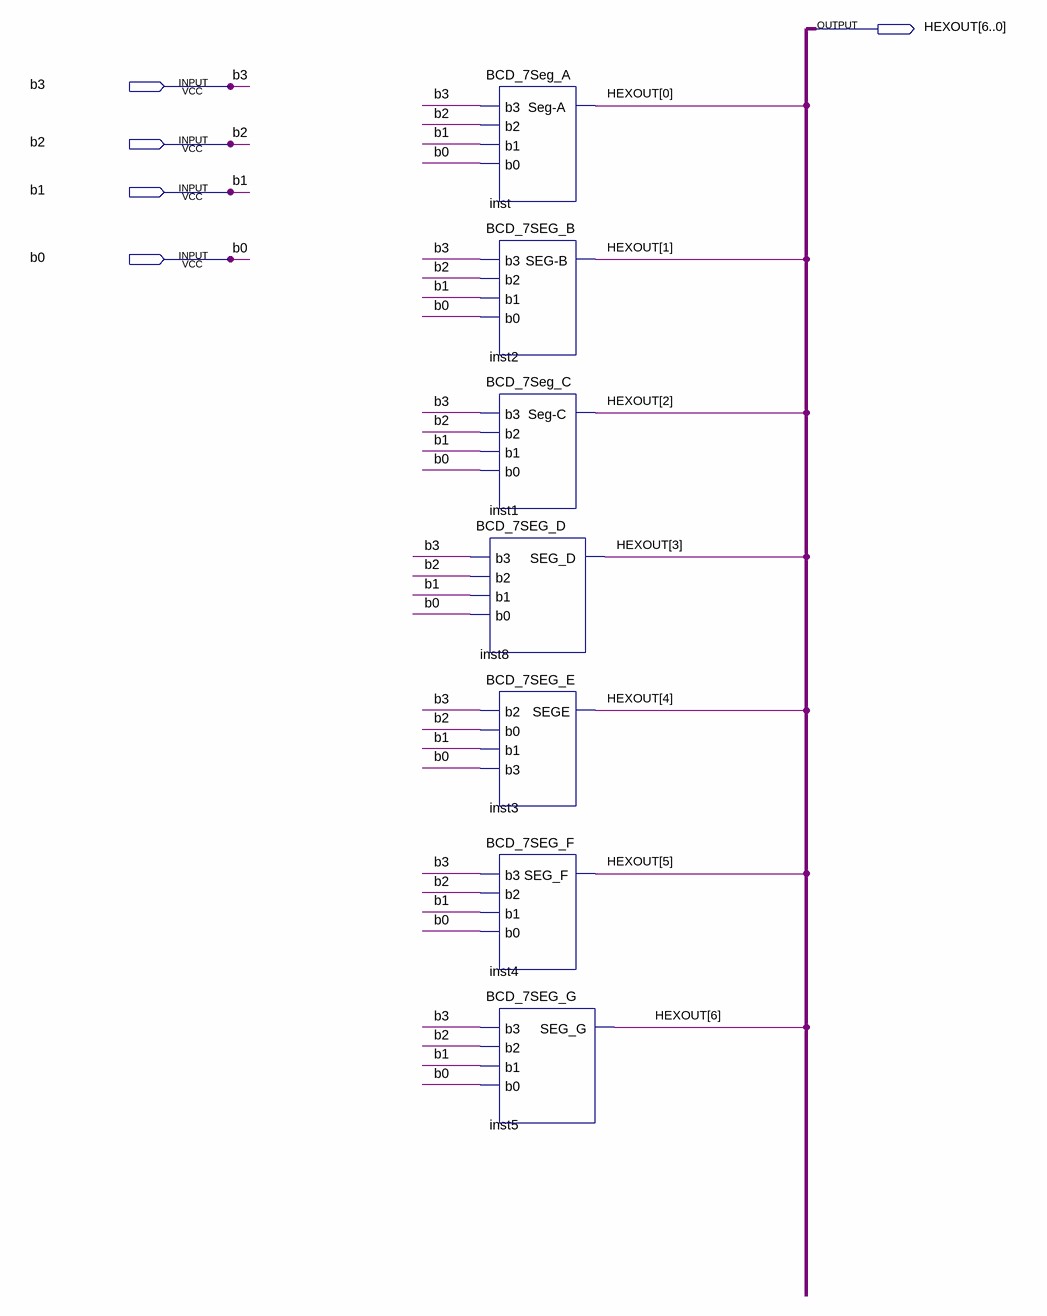
[diagram p0: schematic sheet]
// Quartus schematic BCD_7SEG.bdf as structural Verilog: 7 symbols, 5 pins
module BCD_7SEG (
  input  b3,
  input  b2,
  input  b1,
  input  b0,
  output [6:0] HEXOUT
);

  BCD_7SEG_D inst8 (.b3(b3), .b2(b2), .b1(b1), .b0(b0), .SEG_D(HEXOUT[3]));
  BCD_7Seg_A inst (.b3(b3), .b2(b2), .b1(b1), .b0(b0), .\Seg-A (HEXOUT[0]));
  BCD_7SEG_B inst2 (.b3(b3), .b2(b2), .b1(b1), .b0(b0), .\SEG-B (HEXOUT[1]));
  BCD_7Seg_C inst1 (.b3(b3), .b2(b2), .b1(b1), .b0(b0), .\Seg-C (HEXOUT[2]));
  BCD_7SEG_E inst3 (.b2(b3), .b0(b2), .b1(b1), .b3(b0), .SEGE(HEXOUT[4]));
  BCD_7SEG_F inst4 (.b3(b3), .b2(b2), .b1(b1), .b0(b0), .SEG_F(HEXOUT[5]));
  BCD_7SEG_G inst5 (.b3(b3), .b2(b2), .b1(b1), .b0(b0), .SEG_G(HEXOUT[6]));
endmodule
